# Altium schematic sheet TapeSensing.SchDoc
size A
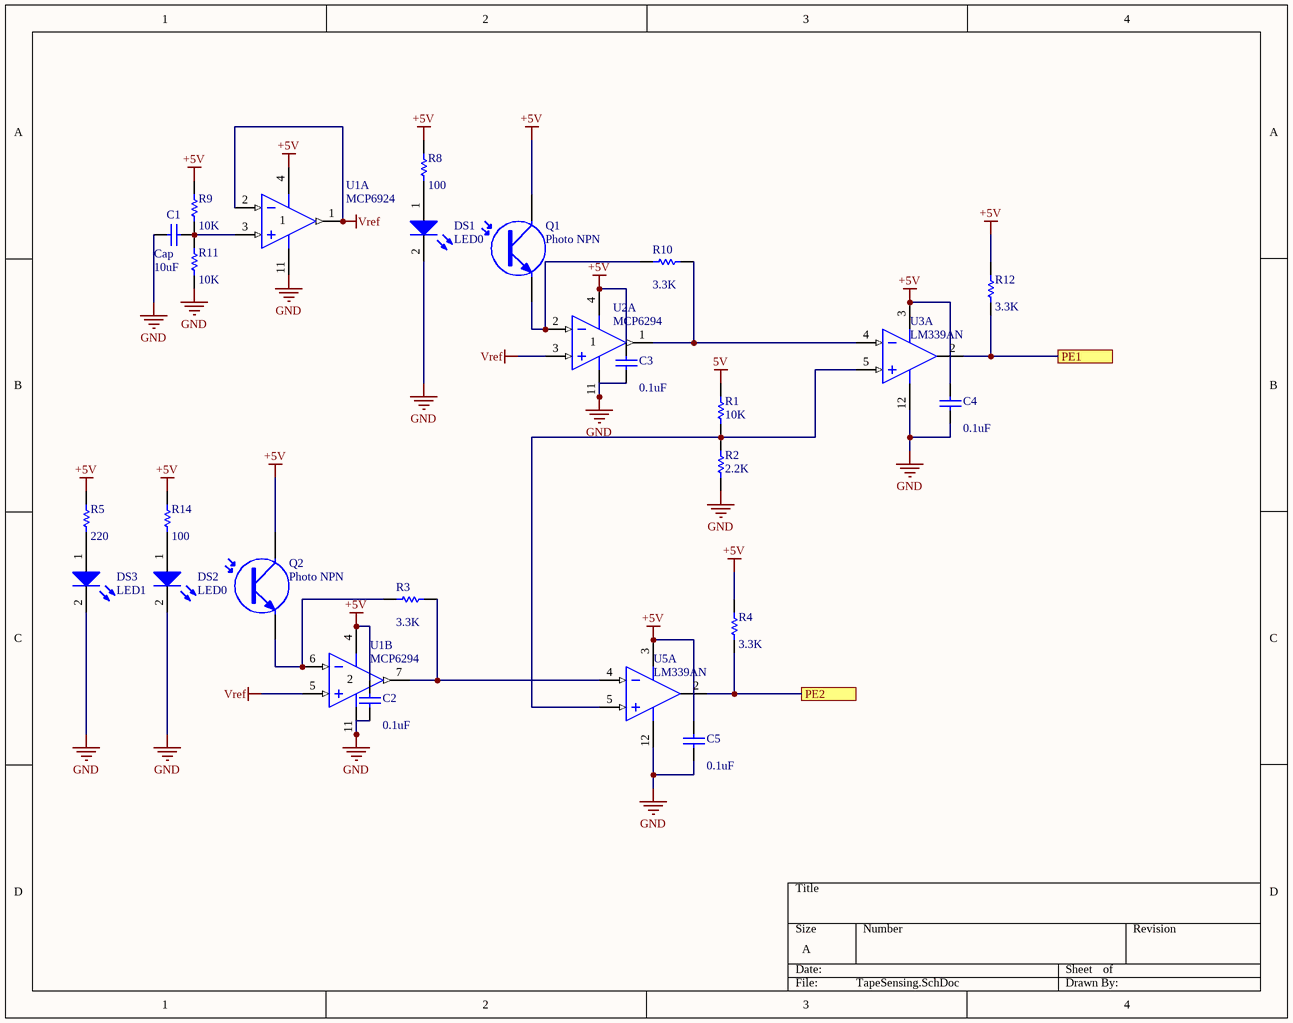
[diagram p0: TapeSensing.SchDoc]

## Parts
(Parts that share a designator on the sheet are numbered #1, #2 ... from top to bottom, then left to right.)
C1  Cap  value 10uF  [RAD-0.3]
C2  value 0.1uF  [RAD-0.3]  (hidden comment: BypassCap)
C3  value 0.1uF  [RAD-0.3]  (hidden comment: BypassCap)
C4  value 0.1uF  [RAD-0.3]  (hidden comment: BypassCap)
C5  value 0.1uF  [RAD-0.3]  (hidden comment: BypassCap)
DS1  LED0  [LED-0]
DS2  LED0  [LED-0]
DS3  LED1  [LED-1]
Q1  Photo NPN  [SFM-T2(3)/X1.6V]
Q2  Photo NPN  [SFM-T2(3)/X1.6V]
R1  value 10K  [AXIAL-0.3]  (hidden comment: Res1)
R2  value 2.2K  [AXIAL-0.3]  (hidden comment: Res1)
R3  value 3.3K  [AXIAL-0.3]  (hidden comment: Res1)
R4  value 3.3K  [AXIAL-0.3]  (hidden comment: Res1)
R5  value 220  [AXIAL-0.3]  (hidden comment: Res1)
R8  value 100  [AXIAL-0.3]  (hidden comment: Res1)
R9  value 10K  [AXIAL-0.3]  (hidden comment: Res1)
R10  value 3.3K  [AXIAL-0.3]  (hidden comment: Res1)
R11  value 10K  [AXIAL-0.3]  (hidden comment: Res1)
R12  value 3.3K  [AXIAL-0.3]  (hidden comment: Res1)
R14  value 100  [AXIAL-0.3]  (hidden comment: Res1)
U1#1  MCP6924  [DIP-14]  (part A of 4)
U1#2  MCP6294  [DIP-14/D19.7]  (part B of 4)
U2  MCP6294  [DIP-14/D19.7]  (part A of 4)
U3  LM339AN  [DIP-14/D19.7]  (part A of 4)
U5  LM339AN  [DIP-14/D19.7]  (part A of 4)

## Ports
PE1, PE2

## Nets
5V: R1.1
+5V: C2.1 C3.1 C4.1 C5.1 Q1.1(C) Q2.1(C) R4.2 R5.2 R8.2 R9.2 R12.2 R14.2 U1#1.4(V+) U1#2.4(V+) U2.4(V+) U3.3(V+) U5.3(V+)
GND: C1.1 C2.2 C3.2 C4.2 C5.2 DS1.2(K) DS2.2(K) DS3.2(K) R2.2 R11.1 U1#1.11(GND) U1#2.11(V-) U2.11(V-) U3.12(GND) U5.12(GND)
Vref: U1#1.1(OUT) U1#1.2(IN-) U1#2.5(IN+) U2.3(IN+)
PE1: R12.1 U3.2(OUT) ; port PE1
PE2: R4.1 U5.2(OUT) ; port PE2
NetC1_2: C1.2 R9.1 R11.2 U1#1.3(IN+)
NetDS1_1: DS1.1(A) R8.1
NetDS2_1: DS2.1(A) R14.1
NetDS3_1: DS3.1(A) R5.1
NetQ1_3: Q1.3(E) R10.1 U2.2(IN-)
NetQ2_3: Q2.3(E) R3.1 U1#2.6(IN-)
NetR1_2: R1.2 R2.1 U3.5(IN+) U5.5(IN+)
NetR3_2: R3.2 U1#2.7(OUT) U5.4(IN-)
NetR10_2: R10.2 U2.1(OUT) U3.4(IN-)

## Library data of the parts
C1-C5 = Cap: Capacitor; Manufacturer: Generic Components; Class: Passive; Published: 08/06/2000; Publisher: Altium Hobart Technology Centre; SubClass: Capacitor
DS1 DS2 = LED0: Typical INFRARED GaAs LED; Manufacturer: Generic Components; Class: Optoelectronic; Published: 08/06/2000; Publisher: Altium Hobart Technology Centre; SubClass: LED
DS3 = LED1: Typical RED GaAs LED; Manufacturer: Generic Components; Class: Optoelectronic; Published: 08/06/2000; Publisher: Altium Hobart Technology Centre; SubClass: LED
Q1 Q2 = Photo NPN: NPN Phototransistor; Manufacturer: Generic Components; Class: Optoelectronic; Published: 1999
R1-R5 R8-R12 R14 = Res1: Resistor; Manufacturer: Generic Components; Class: Passive; Published: 08/06/2000; Publisher: Altium Hobart Technology Centre; SubClass: Resistor
U1#1 = LM324AJ: Low-Power Quad Operational Amplifier; Manufacturer: National Semiconductor; Published: 15/04/2002; Publisher: Altium Hobart Technology Centre; Class: Amplifier; SubClass: Operational Amplifier
U1#2 U2 = MCP6294: Quad 1Ma 10MHz Rail-to-Rail I/O Operational Amplifier; Manufacturer: National Semiconductor; Published: 15/04/2002; Publisher: Altium Hobart Technology Centre; Class: Amplifier; SubClass: Operational Amplifier
U3 U5 = LM339AN: Quad Single-Supply Comparator; Manufacturer: Motorola; Class: Analog; Published: 15/04/2002; Publisher: Altium Hobart Technology Centre; SubClass: Comparator